# EAGLE design qo-100-generic-filter (EAGLE 9.6.1)
CNAME: None; CREVISION: 1; DESIGNER: Joao Silva
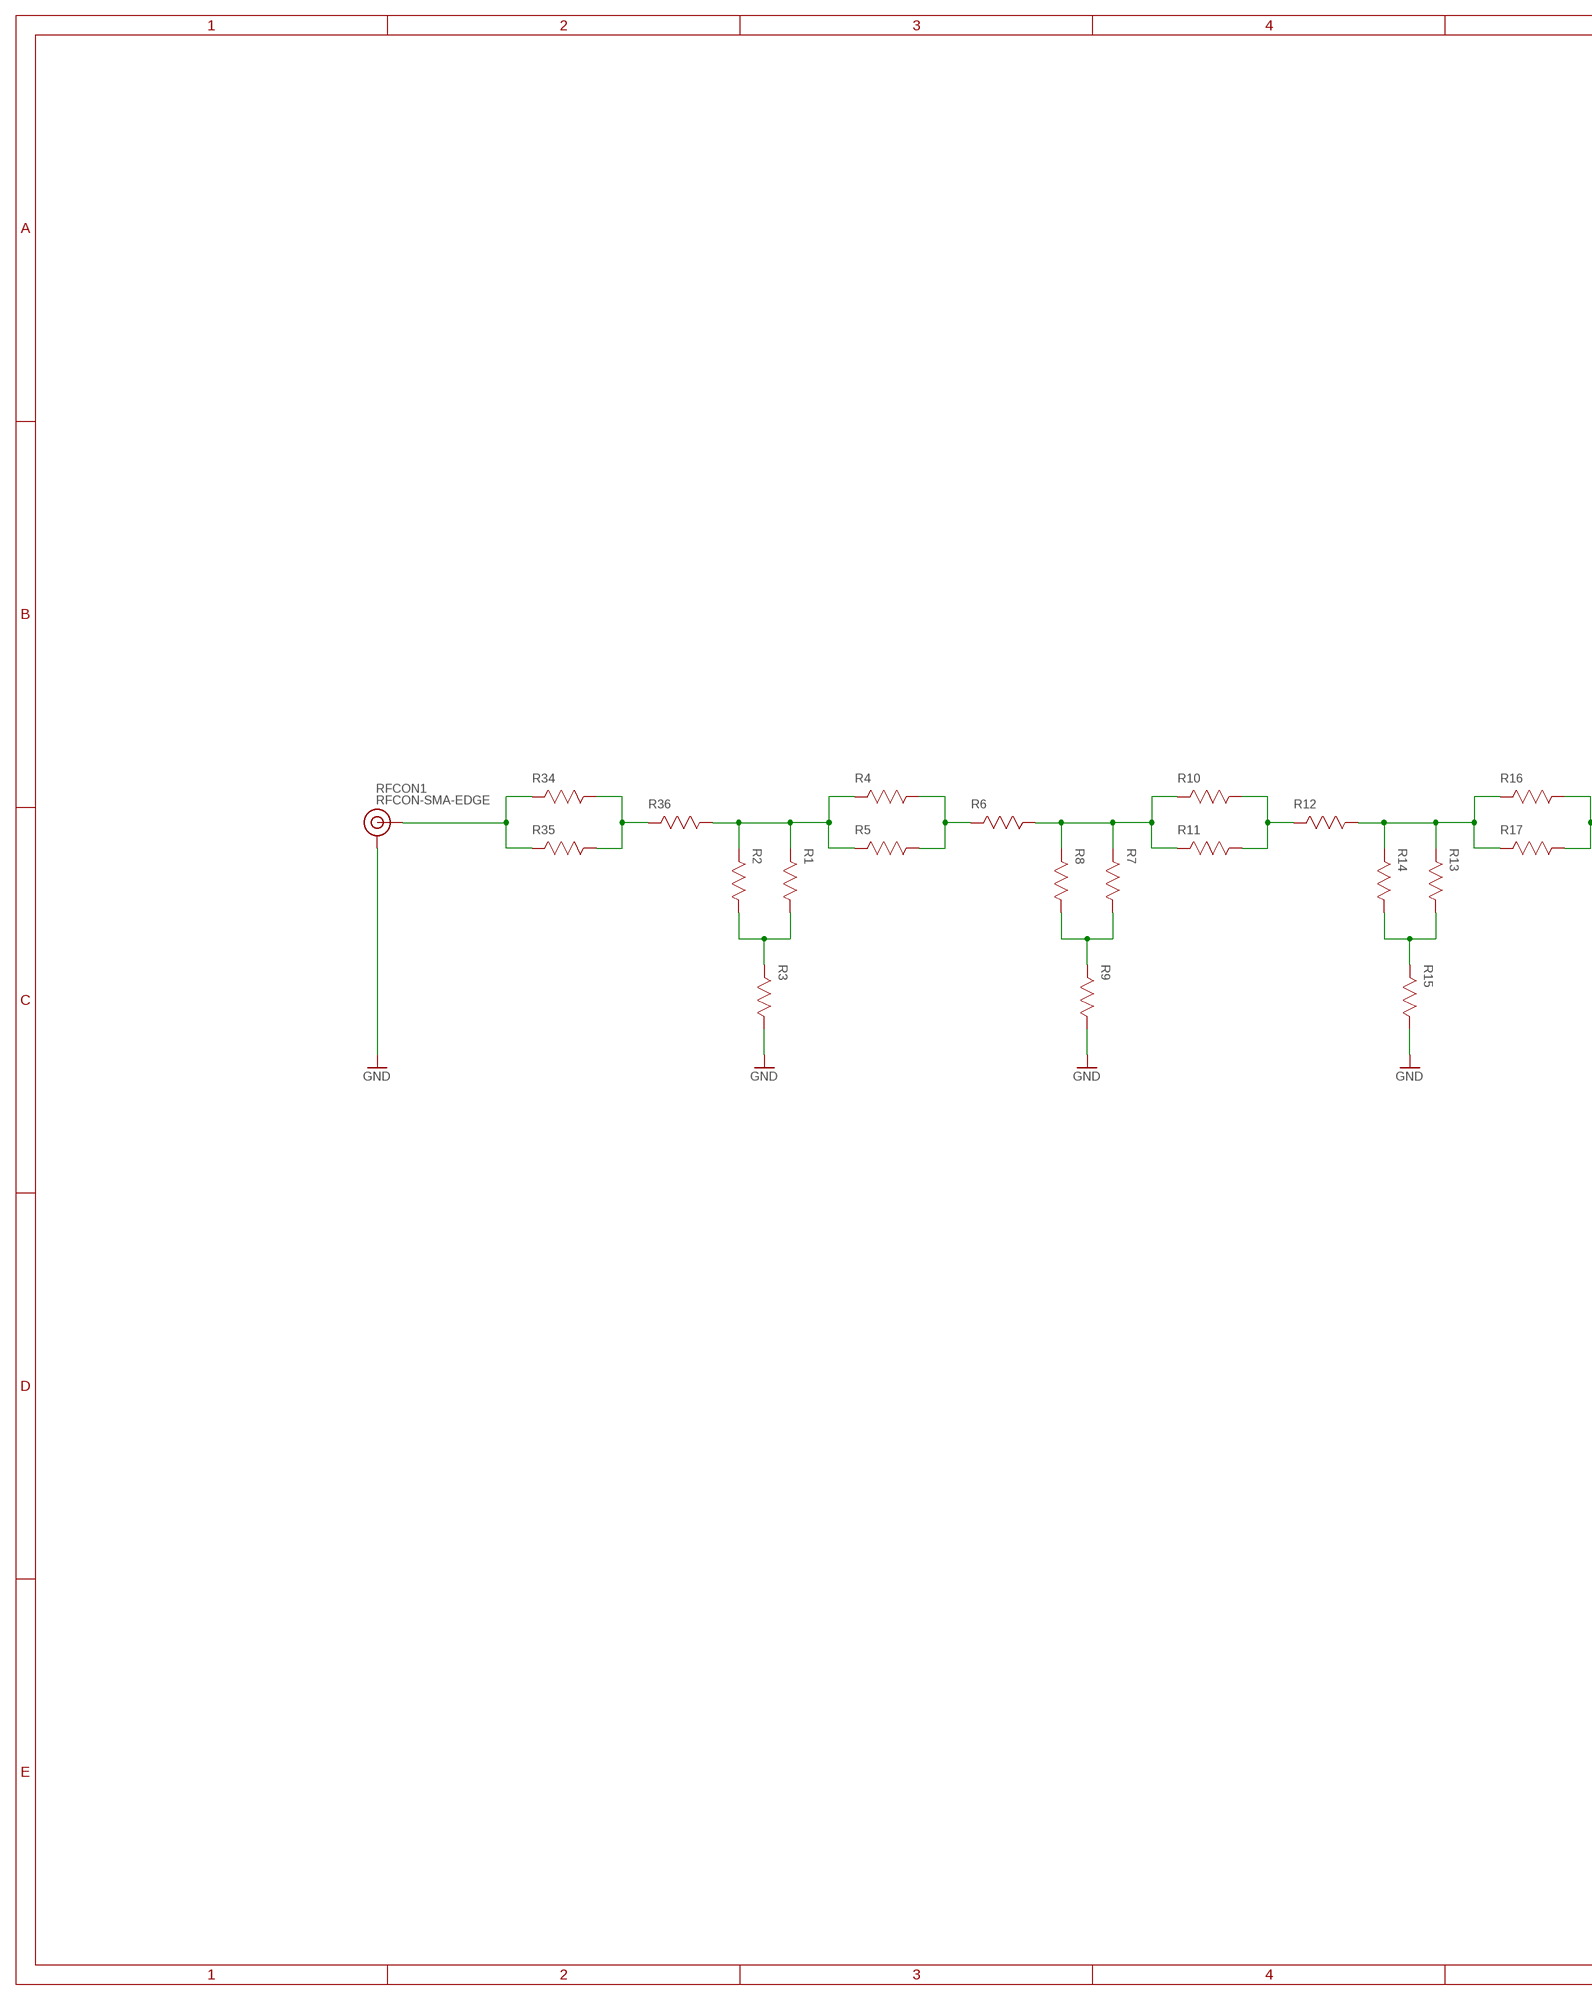
[diagram p0: schematic, sheet 1, part 1 of 2]
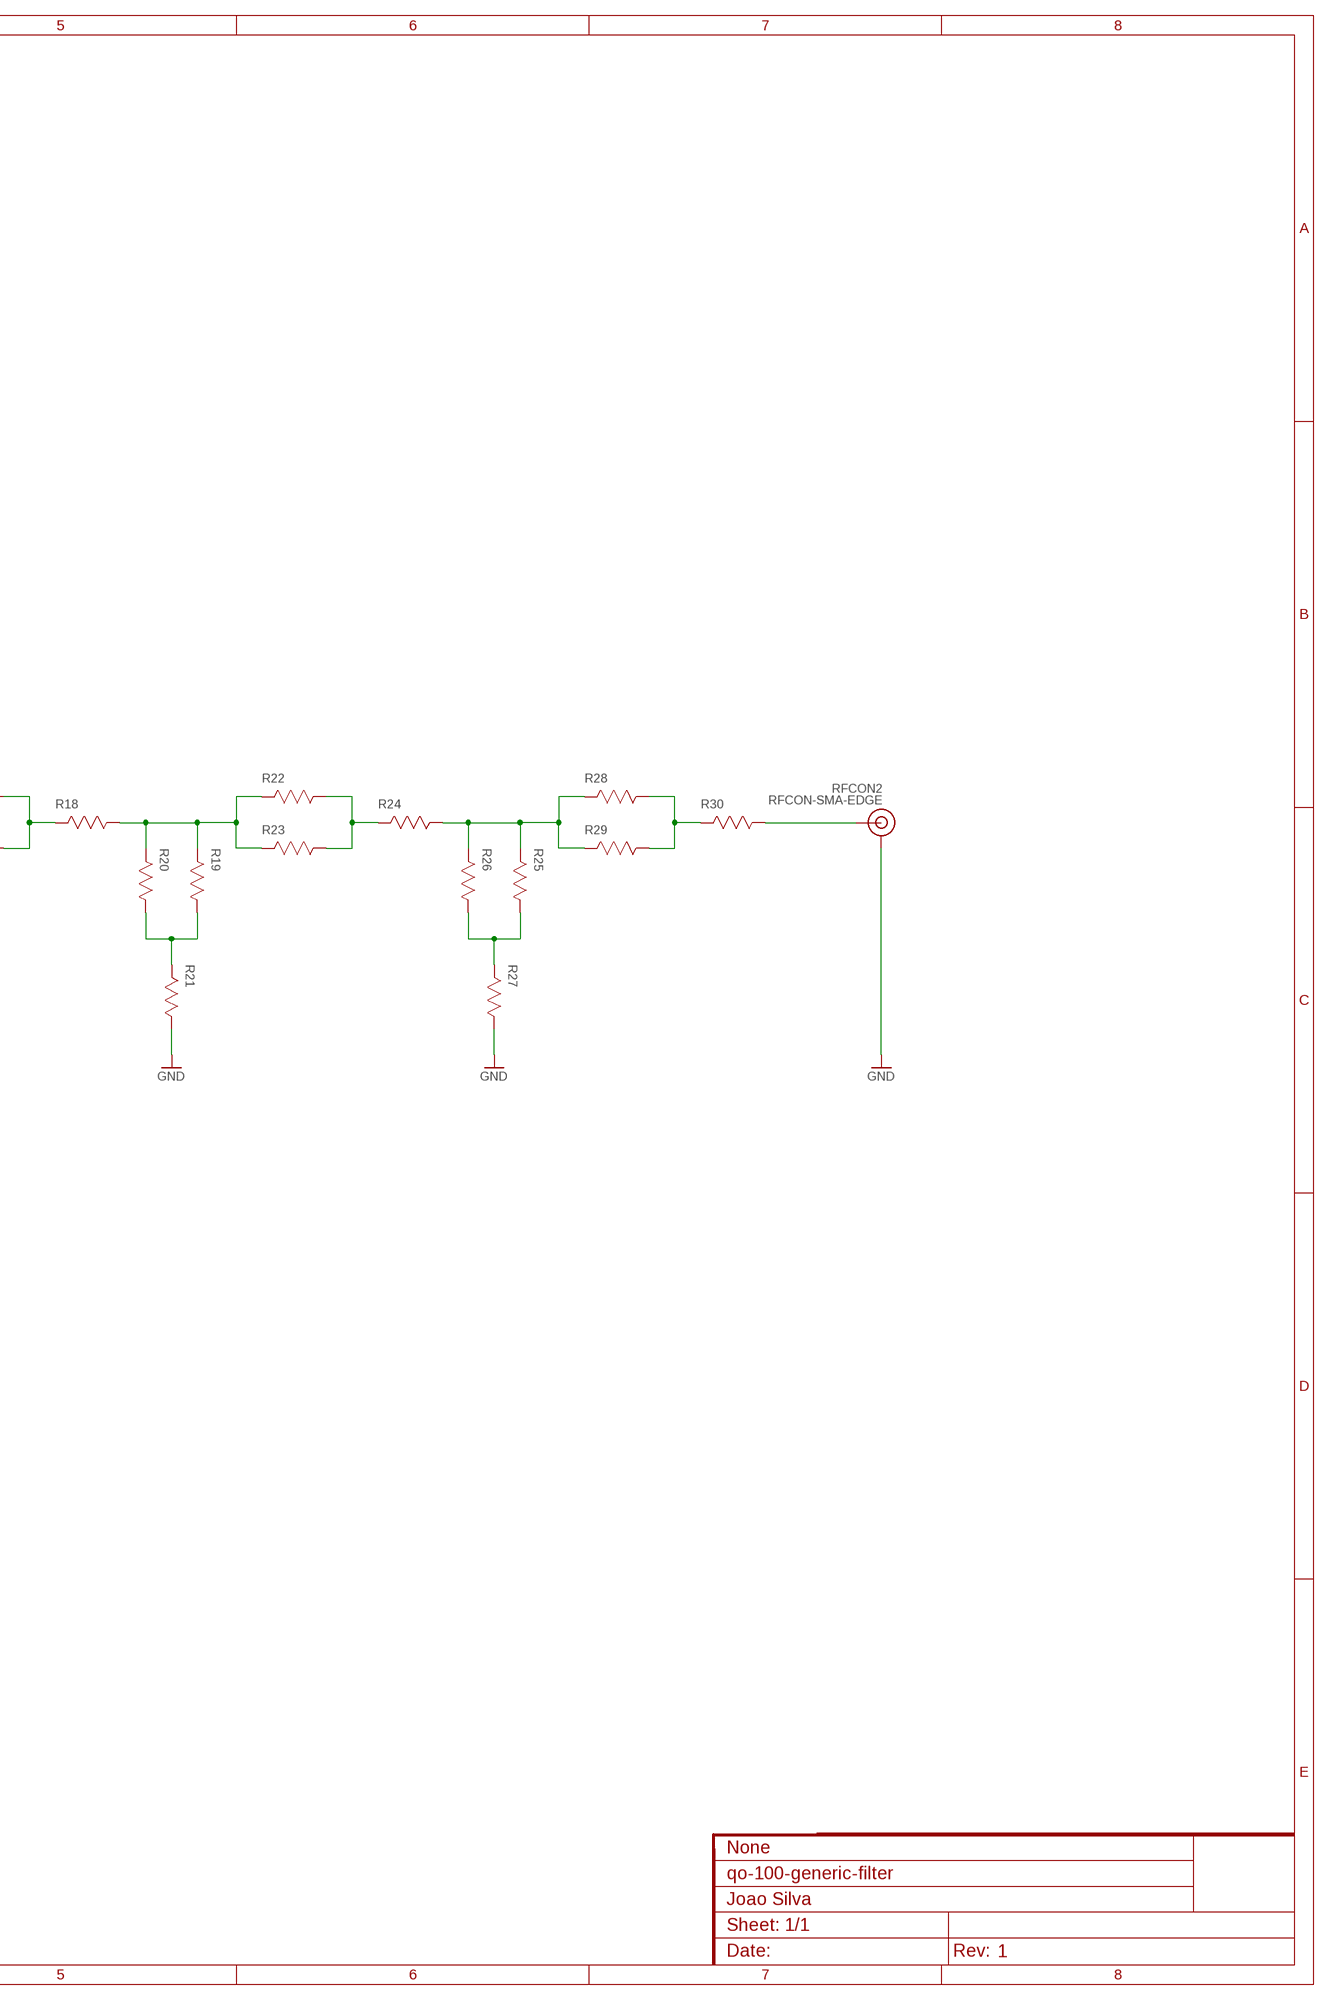
[diagram p1: schematic, sheet 1, part 2 of 2]

## Parts
R1  RESISTOR-0603  [RES0603]
R2  RESISTOR-0603  [RES0603]
R3  RESISTOR-0603  [RES0603]
R4  RESISTOR-0603  [RES0603]
R5  RESISTOR-0603  [RES0603]
R6  RESISTOR-0603  [RES0603]
R7  RESISTOR-0603  [RES0603]
R8  RESISTOR-0603  [RES0603]
R9  RESISTOR-0603  [RES0603]
R10  RESISTOR-0603  [RES0603]
R11  RESISTOR-0603  [RES0603]
R12  RESISTOR-0603  [RES0603]
R13  RESISTOR-0603  [RES0603]
R14  RESISTOR-0603  [RES0603]
R15  RESISTOR-0603  [RES0603]
R16  RESISTOR-0603  [RES0603]
R17  RESISTOR-0603  [RES0603]
R18  RESISTOR-0603  [RES0603]
R19  RESISTOR-0603  [RES0603]
R20  RESISTOR-0603  [RES0603]
R21  RESISTOR-0603  [RES0603]
R22  RESISTOR-0603  [RES0603]
R23  RESISTOR-0603  [RES0603]
R24  RESISTOR-0603  [RES0603]
R25  RESISTOR-0603  [RES0603]
R26  RESISTOR-0603  [RES0603]
R27  RESISTOR-0603  [RES0603]
R28  RESISTOR-0603  [RES0603]
R29  RESISTOR-0603  [RES0603]
R30  RESISTOR-0603  [RES0603]
R34  RESISTOR-0603  [RES0603]
R35  RESISTOR-0603  [RES0603]
R36  RESISTOR-0603  [RES0603]
RFCON1  RFCON-SMA-EDGE  [SMA-EDGE]
RFCON2  RFCON-SMA-EDGE  [SMA-EDGE]

## Nets
GND: R3.1 R9.1 R15.1 R21.1 R27.1 RFCON1.GND@0(GND) RFCON1.GND@1(GND) RFCON1.GND@2(GND) RFCON1.GND@3(GND) RFCON2.GND@0(GND) RFCON2.GND@1(GND) RFCON2.GND@2(GND) RFCON2.GND@3(GND)
N$1: R1.2 R2.2 R4.2 R5.2 R36.1
N$2: R1.1 R2.1 R3.2
N$3: R6.1 R7.2 R8.2 R10.2 R11.2
N$4: R4.1 R5.1 R6.2
N$5: R7.1 R8.1 R9.2
N$6: R10.1 R11.1 R12.2
N$7: R12.1 R13.2 R14.2 R16.2 R17.2
N$8: R13.1 R14.1 R15.2
N$9: R16.1 R17.1 R18.2
N$10: R18.1 R19.2 R20.2 R22.2 R23.2
N$11: R19.1 R20.1 R21.2
N$12: R22.1 R23.1 R24.2
N$13: R24.1 R25.2 R26.2 R28.2 R29.2
N$14: R25.1 R26.1 R27.2
N$15: R28.1 R29.1 R30.2
N$16: R30.1 RFCON2.SIG(SIGNAL)
N$18: R34.2 R35.2 RFCON1.SIG(SIGNAL)
N$19: R34.1 R35.1 R36.2

## Library data of the parts
R1-R30 R34-R36 = Resistor:RESISTOR
RFCON1 RFCON2 = RF Connector:RFCON

## Board
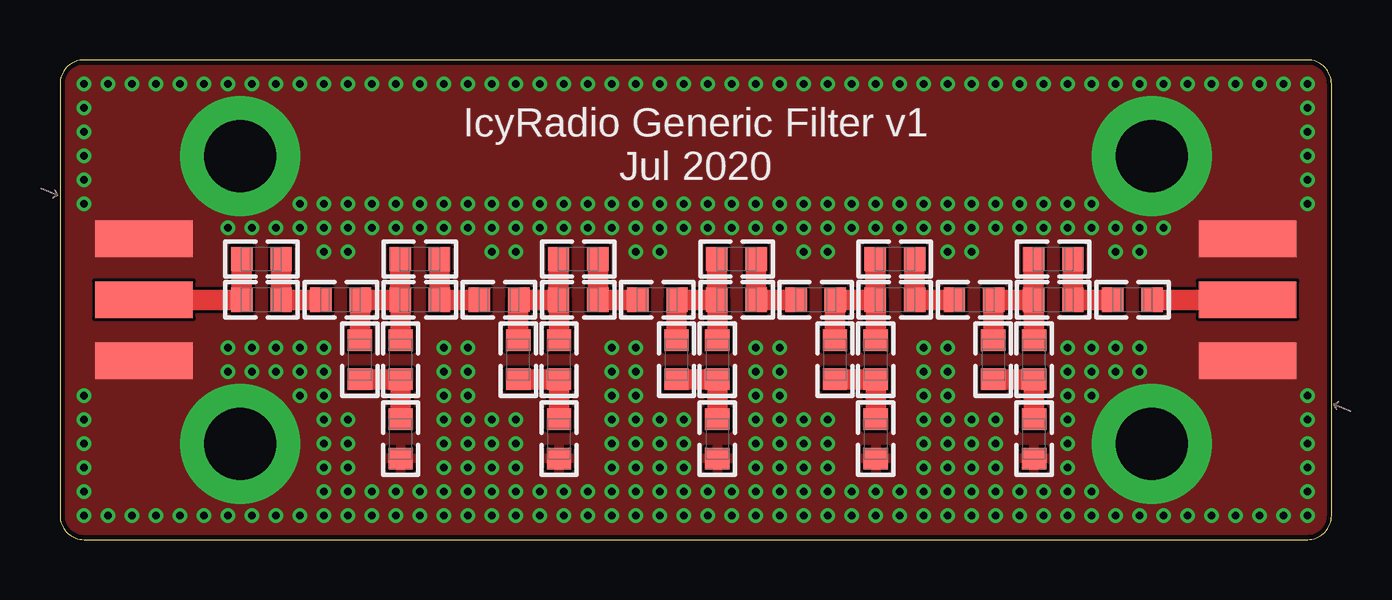
[diagram p2: board, top side]
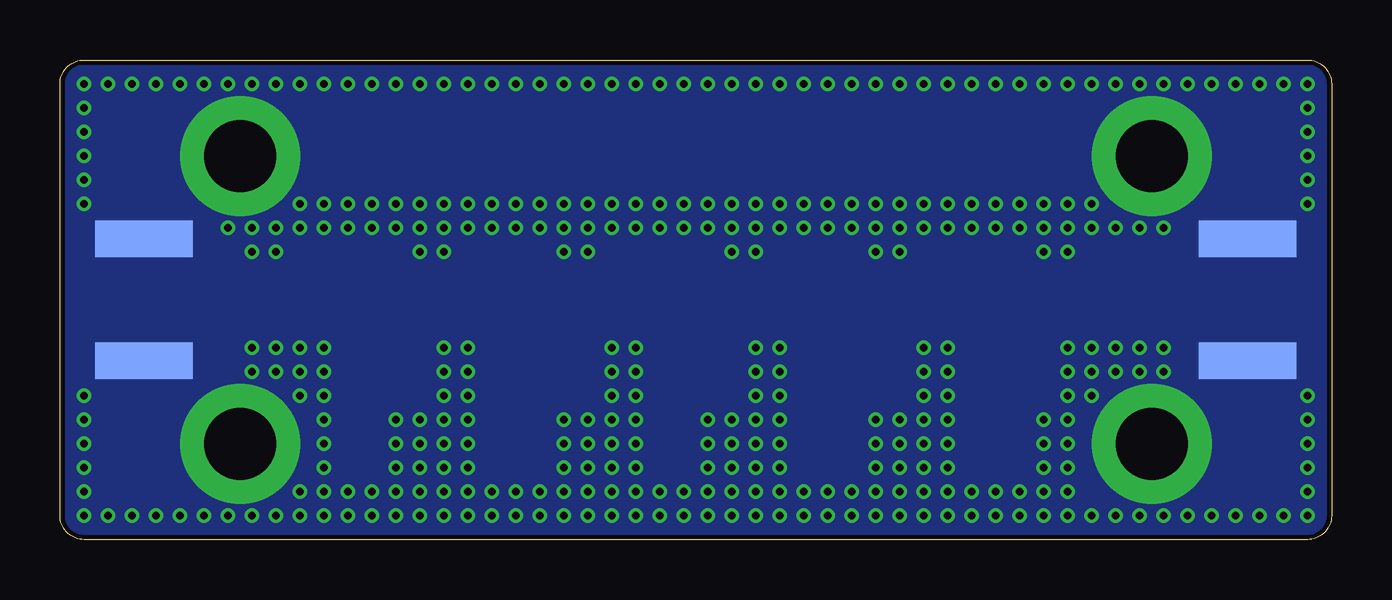
[diagram p3: board, bottom side, seen from below]

Size 53 x 20 mm. Coordinates in mm from the lower left corner, seen from the top.
Outline: 1,0 52,0 arc90 53,1 53,19 arc90 52,20 1,20 arc90 0,19 0,1 arc90 1,0
Copper layers (1*16): Top 0.035mm / dielectric 1.6mm / Bottom 0.035mm
Design rules "jlcpcb_2layer": minimum track width 5mil, minimum drill 0.3mm, track to track 5mil, track to pad 5mil, pad to pad 5mil, via to via 5mil, smd to smd 5mil, copper to edge 0.2mm, drill to drill 5mil, minimum pad ring 3mil, minimum via ring 3mil, stop-mask expansion 0.075mm, vias tented up to drill 10mm, thermal gap 5mil

### Footprints (pad centres in the part's own frame; a part is rotated, then mirrored left to right if it is on the bottom)
RES0603 = smd 0.889 x 1.016: 1 -0.819,0; 2 0.819,0
SMA-EDGE = smd 1.524 x 4.064: GND@0 -2.54,0; GND@1 2.54,0; SIG 0,0 | smd 1.524 x 4.064 bottom: GND@2 -2.54,0; GND@3 2.54,0

### Placement (x,y rotation side)
R1  12.5,7.5 90 top
R2  14.2,7.5 90 top
R3  14.2,4.2 90 top
R4  15,10 180 top
R5  15,11.7 180 top
R6  18.3,10 180 top
R7  19.1,7.5 90 top
R8  20.8,7.5 90 top
R9  20.8,4.2 90 top
R10  21.6,10 180 top
R11  21.6,11.7 180 top
R12  24.9,10 180 top
R13  25.7,7.5 90 top
R14  27.4,7.5 90 top
R15  27.4,4.2 90 top
R16  28.2,10 180 top
R17  28.2,11.7 180 top
R18  31.5,10 180 top
R19  32.3,7.5 90 top
R20  34,7.5 90 top
R21  34,4.2 90 top
R22  34.8,10 180 top
R23  34.8,11.7 180 top
R24  38.1,10 180 top
R25  38.9,7.5 90 top
R26  40.6,7.5 90 top
R27  40.6,4.2 90 top
R28  41.4,10 180 top
R29  41.4,11.7 180 top
R30  44.7,10 180 top
R34  8.4,11.7 180 top
R35  8.4,10 180 top
R36  11.7,10 180 top
RFCON1  3.5,10 270 top
RFCON2  49.5,10 90 top

### Tracks (layer width: path | path; a pad name or v marks a point on that pad's centre or on a via)
GND  (via drill 0.3, 3 pad 5)
  other vias: 1,1 3,1 4,1 5,1 6,1 7,1 48,1 49,1 50,1 51,1 52,1 20,1 21,1 22,1 23,1 45,1 46,1 14,1 15,1 16,1 17,1 18,1 19,1 8,1 9,1 10,1 11,1 12,1 13,1 1,3 1,4 1,5 1,6 1,2 52,3 52,4 52,5 52,6 52,2 16,2 15,2 17,3 17,2 17,4 17,6 17,5 18,5 19,4 19,3 19,2 18,3 18,2 16,4 16,3 16,7 16,6 16,5 17,8 16,8 17,7 19,5 18,4 21,2 20,2 22,2 24,3 24,2 24,4 24,6 24,5 24,7 23,7 23,6 23,8 24,8 29,8 30,8 30,7 29,7 29,6 30,6 30,5 29,4 29,3 29,5 31,5 32,5 32,4 32,3 32,2 34,1 35,1 36,1 37,1 31,1 32,1 33,1 27,1 28,1 29,1 30,1 24,1 25,1 26,1 28,2 26,3 26,2 25,3 25,2 23,4 23,3 23,5 25,5 26,5 26,4 25,4 23,2 14,2 13,2 12,3 12,2 11,3 11,2 12,4 12,5 11,5 11,4 11,6 10,7 11,7 10,6 9,7 7,7 8,7 8,8 9,8 7,8 10,8 11,8 12,13 11,13 10,13 9,13 15,13 14,13 13,13 12,14 11,14 10,14 15,14 14,14 13,14 46,13 33,13 32,13 31,13 30,13 8,13 7,13 39,13 38,13 37,13 36,13 35,13 34,13 45,13 44,13 43,13 42,13 41,13 40,13 33,14 32,14 31,14 30,14 39,14 38,14 37,14 36,14 35,14 34,14 43,14 42,14 41,14 40,14 19,14 18,14 17,14 16,14 22,14 21,14 20,14 19,13 18,13 17,13 16,13 22,13 21,13 20,13 19,12 18,12 12,12 11,12 25,12 24,12 26,13 25,13 24,13 23,13 29,13 28,13 27,13 26,14 25,14 24,14 23,14 29,14 28,14 27,14 12,19 11,19 10,19 9,19 15,19 14,19 13,19 52,19 51,19 50,19 49,19 48,19 46,19 6,19 5,19 4,19 3,19 1,19 33,19 32,19 31,19 30,19 8,19 7,19 39,19 38,19 37,19 36,19 35,19 34,19 45,19 44,19 43,19 42,19 41,19 40,19 52,17 52,16 52,15 52,14 52,18 1,17 1,16 1,15 1,14 1,18 19,19 18,19 17,19 16,19 22,19 21,19 20,19 26,19 25,19 24,19 23,19 29,19 28,19 27,19 45,12 44,12 38,12 37,12 32,12 31,12 36,7 36,6 37,6 37,5 36,4 36,3 37,3 37,2 38,3 38,2 39,3 39,2 41,1 42,1 43,1 44,1 38,1 39,1 40,1 44,7 43,6 42,7 42,6 43,7 43,8 42,8 44,8 45,8 45,7 43,2 42,5 42,4 42,3 42,2 41,2 40,2 39,4 39,5 38,5 38,4 37,4 36,5 37,7 37,8 36,8 31,3 31,2 30,3 30,2 30,4 29,2 27,2 31,4 34,2 33,2 35,2 36,2 2,1 2,19 47,19 47,1 7.5,4 45.5,4 45.5,16 7.5,16
  pour Top: -1,21 54,21 54,-1 -1,-1
  pour Bottom: -2,22 55,22 55,-2 -2,-2
  pour Top (rank 6, no thermals): 1,6 6,6 6,14 1,14
  pour Bottom (rank 6, no thermals): 47,6 52,6 52,14 47,14
  pour Bottom (rank 6, no thermals): 1,6 6,6 6,14 1,14
  pour Top (rank 6, no thermals): 47,6 52,6 52,14 47,14
N$1
  Top 0.85: R4.2 R36.1 12.5,9.98 R1.2 | R4.2 R5.2 | R2.2 14.2,9.98 R4.2
N$2
  Top 0.85: R1.1 R2.1 R3.2
N$3
  Top 0.85: R10.2 R6.1 19.1,9.98 R7.2 | R10.2 R11.2 | R8.2 20.8,9.98 R10.2
N$4
  Top 0.85: R6.2 R4.1 R5.1
N$5
  Top 0.85: R7.1 R8.1 R9.2
N$6
  Top 0.85: R12.2 R10.1 R11.1
N$7
  Top 0.85: R16.2 R12.1 25.7,9.98 R13.2 | R16.2 R17.2 | R14.2 27.4,9.98 R16.2
N$8
  Top 0.85: R13.1 R14.1 R15.2
N$9
  Top 0.85: R18.2 R16.1 R17.1
N$10
  Top 0.85: R22.2 R18.1 32.3,9.98 R19.2 | R22.2 R23.2 | R20.2 34,9.98 R22.2
N$11
  Top 0.85: R19.1 R20.1 R21.2
N$12
  Top 0.85: R24.2 R22.1 R23.1
N$13
  Top 0.85: R28.2 R24.1 38.9,9.98 R25.2 | R28.2 R29.2 | R26.2 40.6,9.98 R28.2
N$14
  Top 0.85: R25.1 R26.1 R27.2
N$15
  Top 0.85: R30.2 R28.1 R29.1
N$16
  Top 0.85: R30.1 RFCON2.SIG
N$18
  Top 0.85: RFCON1.SIG R35.2 R34.2
N$19
  Top 0.85: R34.1 R35.1 R36.2

### Text on the board
tPlace: IcyRadio Generic Filter v1 / Jul 2020